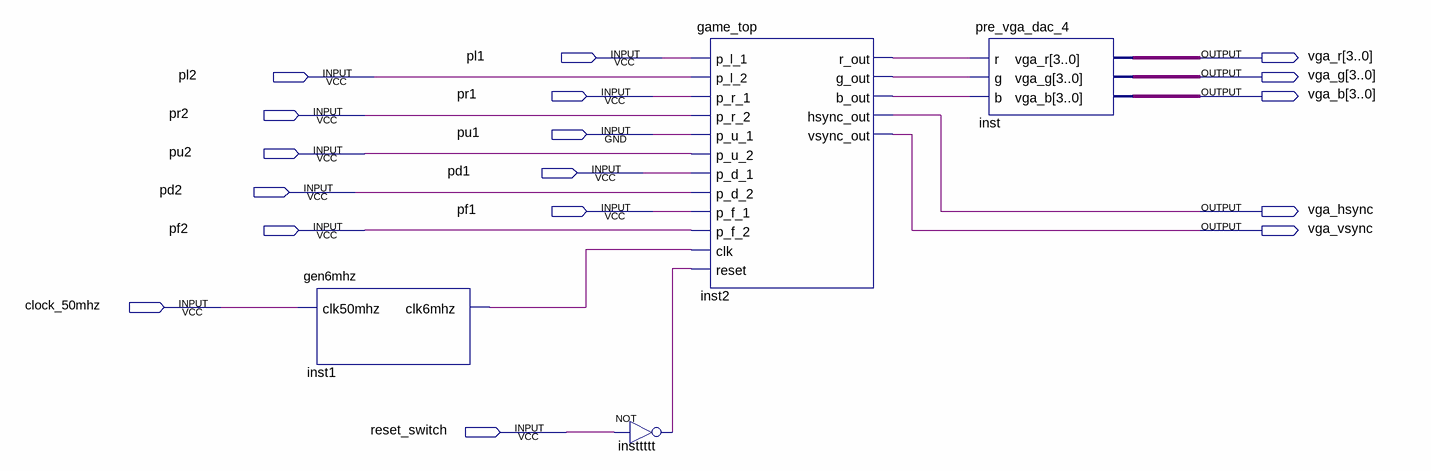
[diagram p0: schematic sheet]
// Quartus schematic top_de1.bdf as structural Verilog: 4 symbols, 17 pins
module top_de1 (
  input  pl1,
  input  pl2,
  input  pr1,
  input  pr2,
  input  pu1,
  input  pu2,
  input  pd1,
  input  pd2,
  input  pf1,
  input  pf2,
  input  clock_50mhz,
  input  reset_switch,
  output [3:0] vga_r,
  output [3:0] vga_g,
  output [3:0] vga_b,
  output vga_hsync,
  output vga_vsync
);

  wire inst1_clk6mhz, inst2_b_out, inst2_g_out, inst2_r_out, insttttt_out;

  gen6mhz inst1 (.clk50mhz(clock_50mhz), .clk6mhz(inst1_clk6mhz));
  not insttttt (insttttt_out, reset_switch);
  game_top inst2 (
    .p_l_1(pl1), .p_l_2(pl2), .p_r_1(pr1), .p_r_2(pr2), .p_u_1(pu1), .p_u_2(pu2), .p_d_1(pd1), .p_d_2(pd2),
    .p_f_1(pf1), .p_f_2(pf2), .clk(inst1_clk6mhz), .reset(insttttt_out), .r_out(inst2_r_out),
    .g_out(inst2_g_out), .b_out(inst2_b_out), .hsync_out(vga_hsync), .vsync_out(vga_vsync));
  pre_vga_dac_4 inst (.r(inst2_r_out), .g(inst2_g_out), .b(inst2_b_out), .vga_r(vga_r), .vga_g(vga_g), .vga_b(vga_b));
endmodule
